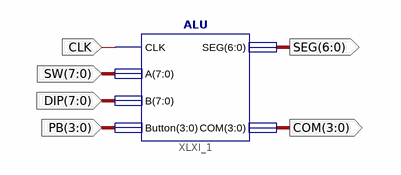
[diagram p0: schematic sheet 1]
// Xilinx ISE schematic main.sch (spartan6) as structural Verilog: 1 symbols, 6 ports
module main (
  input  CLK,
  input  [7:0] SW,
  input  [7:0] DIP,
  input  [3:0] PB,
  output [3:0] COM,
  output [6:0] SEG
);

  ALU XLXI_1 (.CLK(CLK), .A(SW), .B(DIP), .Button(PB), .SEG(SEG), .COM(COM));
endmodule
